# EAGLE schematic mp3431-boost-tester-mk-1.0.0 (EAGLE 9.2.2)
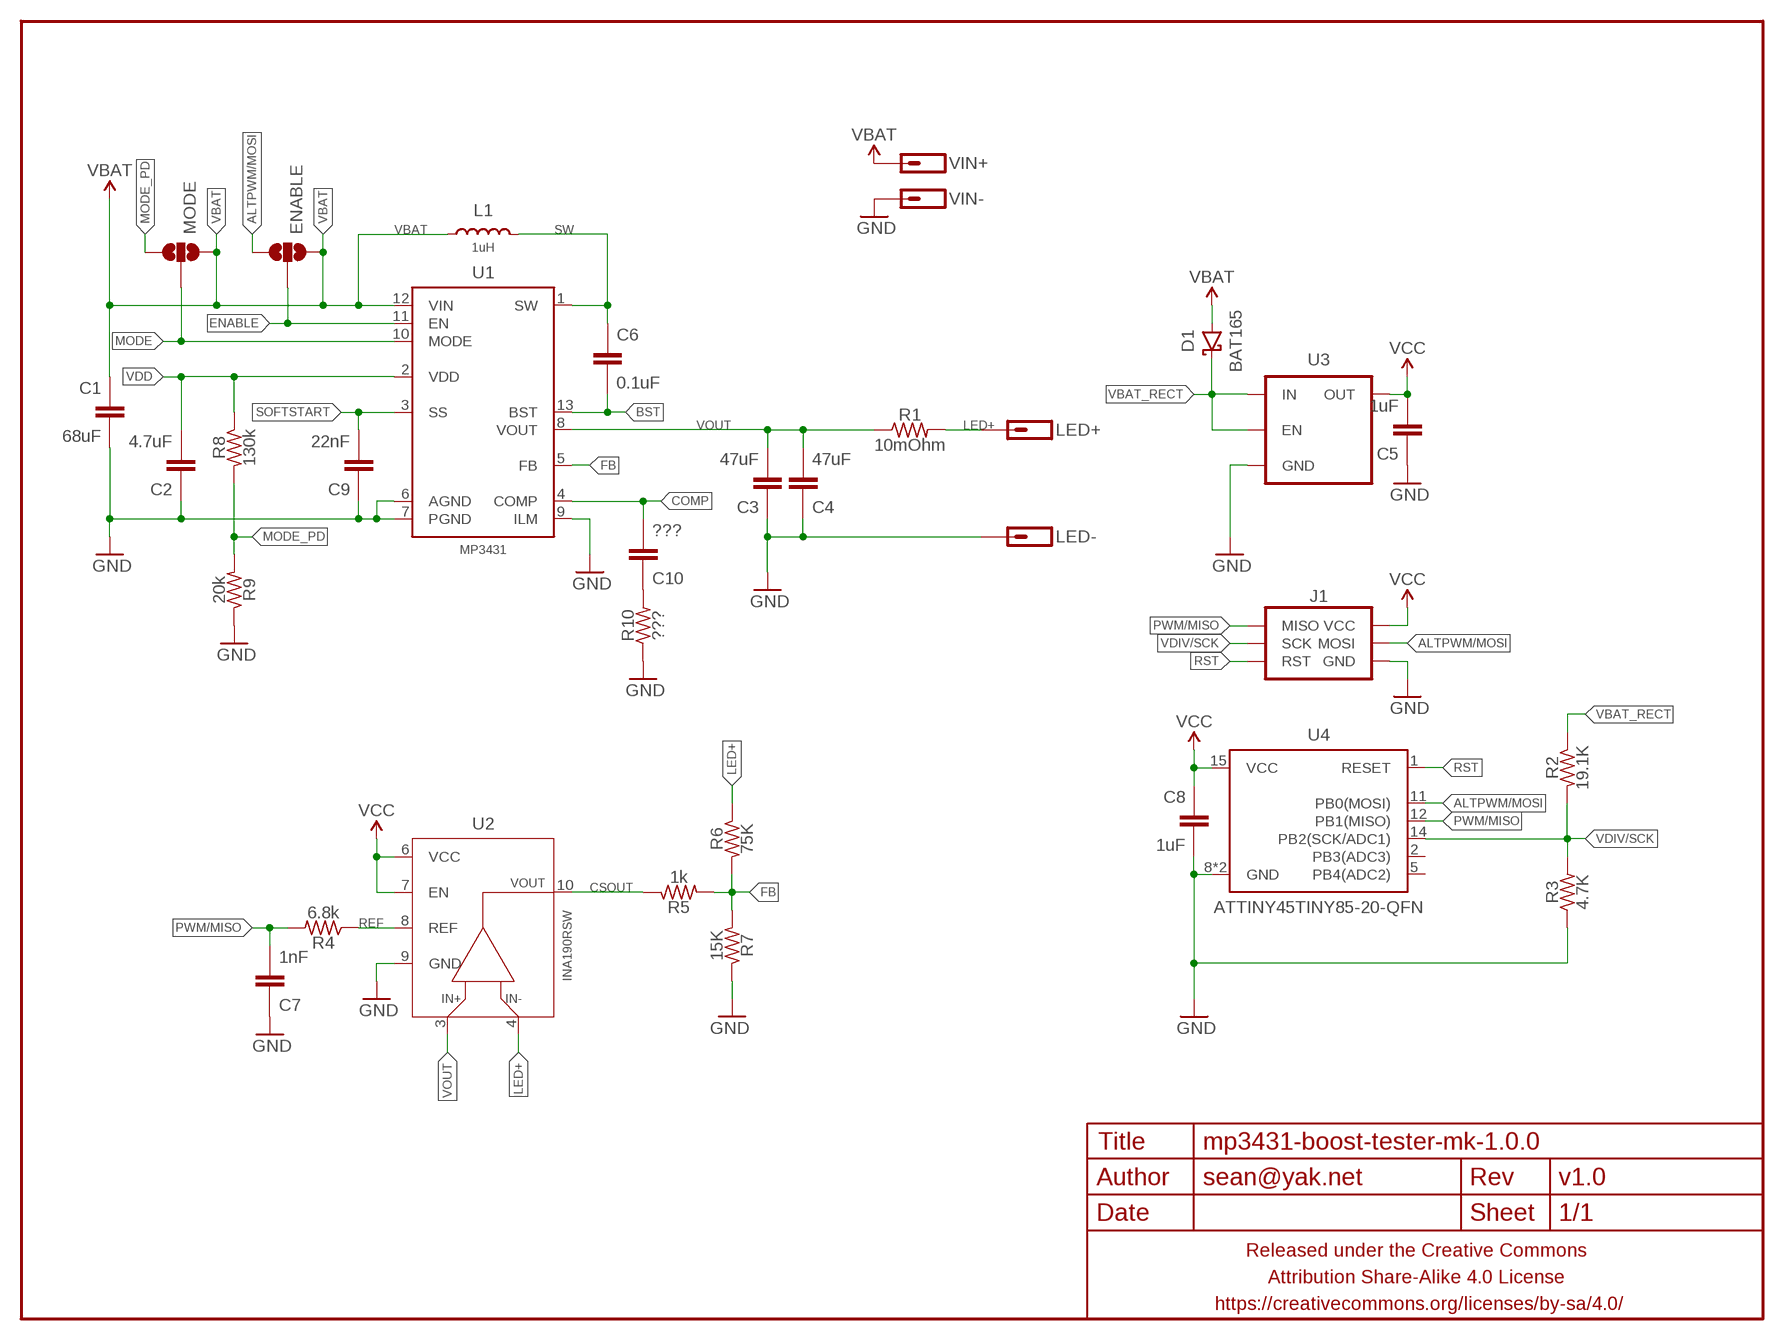
[diagram p0: schematic, sheet 1]

## Parts
C1  68uF  CAPACITOR-CERAMICC1206  [C1206]
C2  4.7uF  CAPACITOR-CERAMICC0402  [C0402]
C3  47uF  CAPACITOR-CERAMICC1206  [C1206]
C4  47uF  CAPACITOR-CERAMICC1206  [C1206]
C5  1uF  CAPACITOR-CERAMICC0402  [C0402]
C6  0.1uF  CAPACITOR-CERAMICC0402  [C0402]
C7  1nF  CAPACITOR-CERAMICC0402  [C0402]
C8  1uF  CAPACITOR-CERAMICC0402  [C0402]
C9  22nF  CAPACITOR-CERAMICC0402  [C0402]
C10  ???  CAPACITOR-CERAMICC0402  [C0402]
D1  BAT165  DIODE-SCHOTTKYSOD323  [SOD323-SCHOTTKY]
ENABLE  JUMPER-PAD-3-NOSMALL_BOX_SILK  [PAD-JUMPER-3-NO_YES_SILK_SMALL_BOX]
FRAME1  FRAME-LETTERNO_PACKAGE  [DUMMY]
J1  AVR_SPI_PRG_6SMD-1.27MM  [2X3-1.27MM-SMD]
L1  1uH  INDUCTORXAL7070  [XAL7070]
LED+  M01PTH-1.2MM-NS  [1X01-1.2MM-NS]
LED-  M01PTH-1.2MM-NS  [1X01-1.2MM-NS]
MODE  JUMPER-PAD-3-NOSMALL_BOX_SILK  [PAD-JUMPER-3-NO_YES_SILK_SMALL_BOX]
R1  10mOhm  RESISTORR1206  [R1206]
R2  19.1K  RESISTORR0402  [R0402]
R3  4.7K  RESISTORR0402  [R0402]
R4  6.8k  RESISTORR0402  [R0402]
R5  1k  RESISTORR0402  [R0402]
R6  75K  RESISTORR0402  [R0402]
R7  15K  RESISTORR0402  [R0402]
R8  130k  RESISTORR0402  [R0402]
R9  20k  RESISTORR0402  [R0402]
R10  ???  RESISTORR0402  [R0402]
U1  MP3431  [MP3431]
U2  INA190RSW  [UQFN-10]
U3  V_REG_ENTLV700  [SC70]
U4  ATTINY45TINY85-20-QFN  [QFN20]
VIN+  M01PTH-1.2MM-NS  [1X01-1.2MM-NS]
VIN-  M01PTH-1.2MM-NS  [1X01-1.2MM-NS]

## Nets
ALTPWM/MOSI: ENABLE.3 J1.4(MOSI) U4.11(PB0(MOSI))
BST: C6.2 U1.13(BST)
COMP: C10.2 U1.4(COMP)
COMP_MID: C10.1 R10.2
CSOUT: R5.1 U2.10(OUT)
ENABLE: ENABLE.2 U1.11(EN)
FB: R5.2 R6.2 R7.2 U1.5(FB)
GND: C1.2 C2.1 C3.1 C4.1 C5.1 C7.1 C8.2 C9.1 J1.6(GND) LED-.P$1 R3.1 R7.1 R9.1 R10.1 U1.6(AGND) U1.7(PGND) U1.9(ILM) U2.9(GND) U3.2(GND) U4.8(GND) U4.PAD(GND) VIN-.P$1
LED+: LED+.P$1 R1.2 R6.1 U2.4(VIN-)
MODE: MODE.2 U1.10(MODE)
MODE_PD: MODE.3 R8.2 R9.2
PWM/MISO: C7.2 J1.1(MISO) R4.2 U4.12(PB1(MISO))
REF: R4.1 U2.8(REF)
RST: J1.5(RST) U4.1(RESET)
SOFTSTART: C9.2 U1.3(SS)
SW: C6.1 L1.P$2 U1.1(SW)
VBAT: C1.1 D1.A ENABLE.1 L1.P$1 MODE.1 U1.12(VIN) VIN+.P$1
VBAT_RECT: D1.C R2.1 U3.1(IN) U3.3(EN)
VCC: C5.2 C8.1 J1.2(VCC) U2.6(VCC) U2.7(EN) U3.5(OUT) U4.15(VCC)
VDD: C2.2 R8.1 U1.2(VDD)
VDIV/SCK: J1.3(SCK) R2.2 R3.2 U4.14(PB2(SCK/ADC1))
VOUT: C3.2 C4.2 R1.1 U1.8(VOUT) U2.3(VIN+)
Unconnected: U4.2(PB3(ADC3)) U4.5(PB4(ADC2))

## Library data of the parts
C1-C10 = a_parts:CAPACITOR-CERAMIC: CAPACITOR, European symbol
D1 = a_parts:DIODE-SCHOTTKY: Schottky diodes in SFE's production catalog BAT20J 1A 23V 0.62Vf RB751 120mA 40V 0.37Vf PMEG4005EJ 0.5A 40V 0.42Vf MBRA140 1A 40V 0.5Vf B340A 3A 40V SMA
ENABLE MODE = a_parts:JUMPER-PAD-3-NO
FRAME1 = a_parts:FRAME-LETTER: Schematic Frame Standard 8.5x11 US Letter frame; DESIGNER: sean@yak.net; VERSION: v1.0
J1 = a_parts:AVR_SPI_PRG_6: AVR ISP 6 Pin This is the reduced ISP connector for AVR programming. Common on Arduino. This footprint will take up less PCB space and can be used with a 10-pin to 6-pin adapter such as SKU: BOB-08508 **Special note about "TEST_POINT" package. The stop mask is on the top side, so if you want your programming test points to be on the bottom of your board, make sure to place this package on the bottom side of the board. This also ensure that the orientation to program from the bottom side will be correct.
L1 = a_parts:INDUCTOR: Inductors Basic Inductor/Choke - 0603 and 1206. Footprints are not proven and vary greatly between part numbers. SRN6045- 33uH, 20% 1.4A SDR0403-560KL - 56uH, 10%, 500mA RMS/740mA peak
LED+ LED- VIN+ VIN- = a_parts:M01: Header 1 Standard 1-pin 0.1" header. Use with straight break away headers (SKU : PRT-00116), right angle break away headers (PRT-00553), swiss pins (PRT-00743), machine pins (PRT-00117), and female headers (PRT-00115).
R1-R10 = a_parts:RESISTOR: RESISTOR, American symbol
U1 = a_parts:MP3431
U2 = a_parts:INA190
U3 = a_parts:V_REG_EN
U4 = a_parts:ATTINY45: Atmel 8-pin 2/4/8kB flash uC